# EAGLE design Hatalogico (EAGLE 7.2.0)
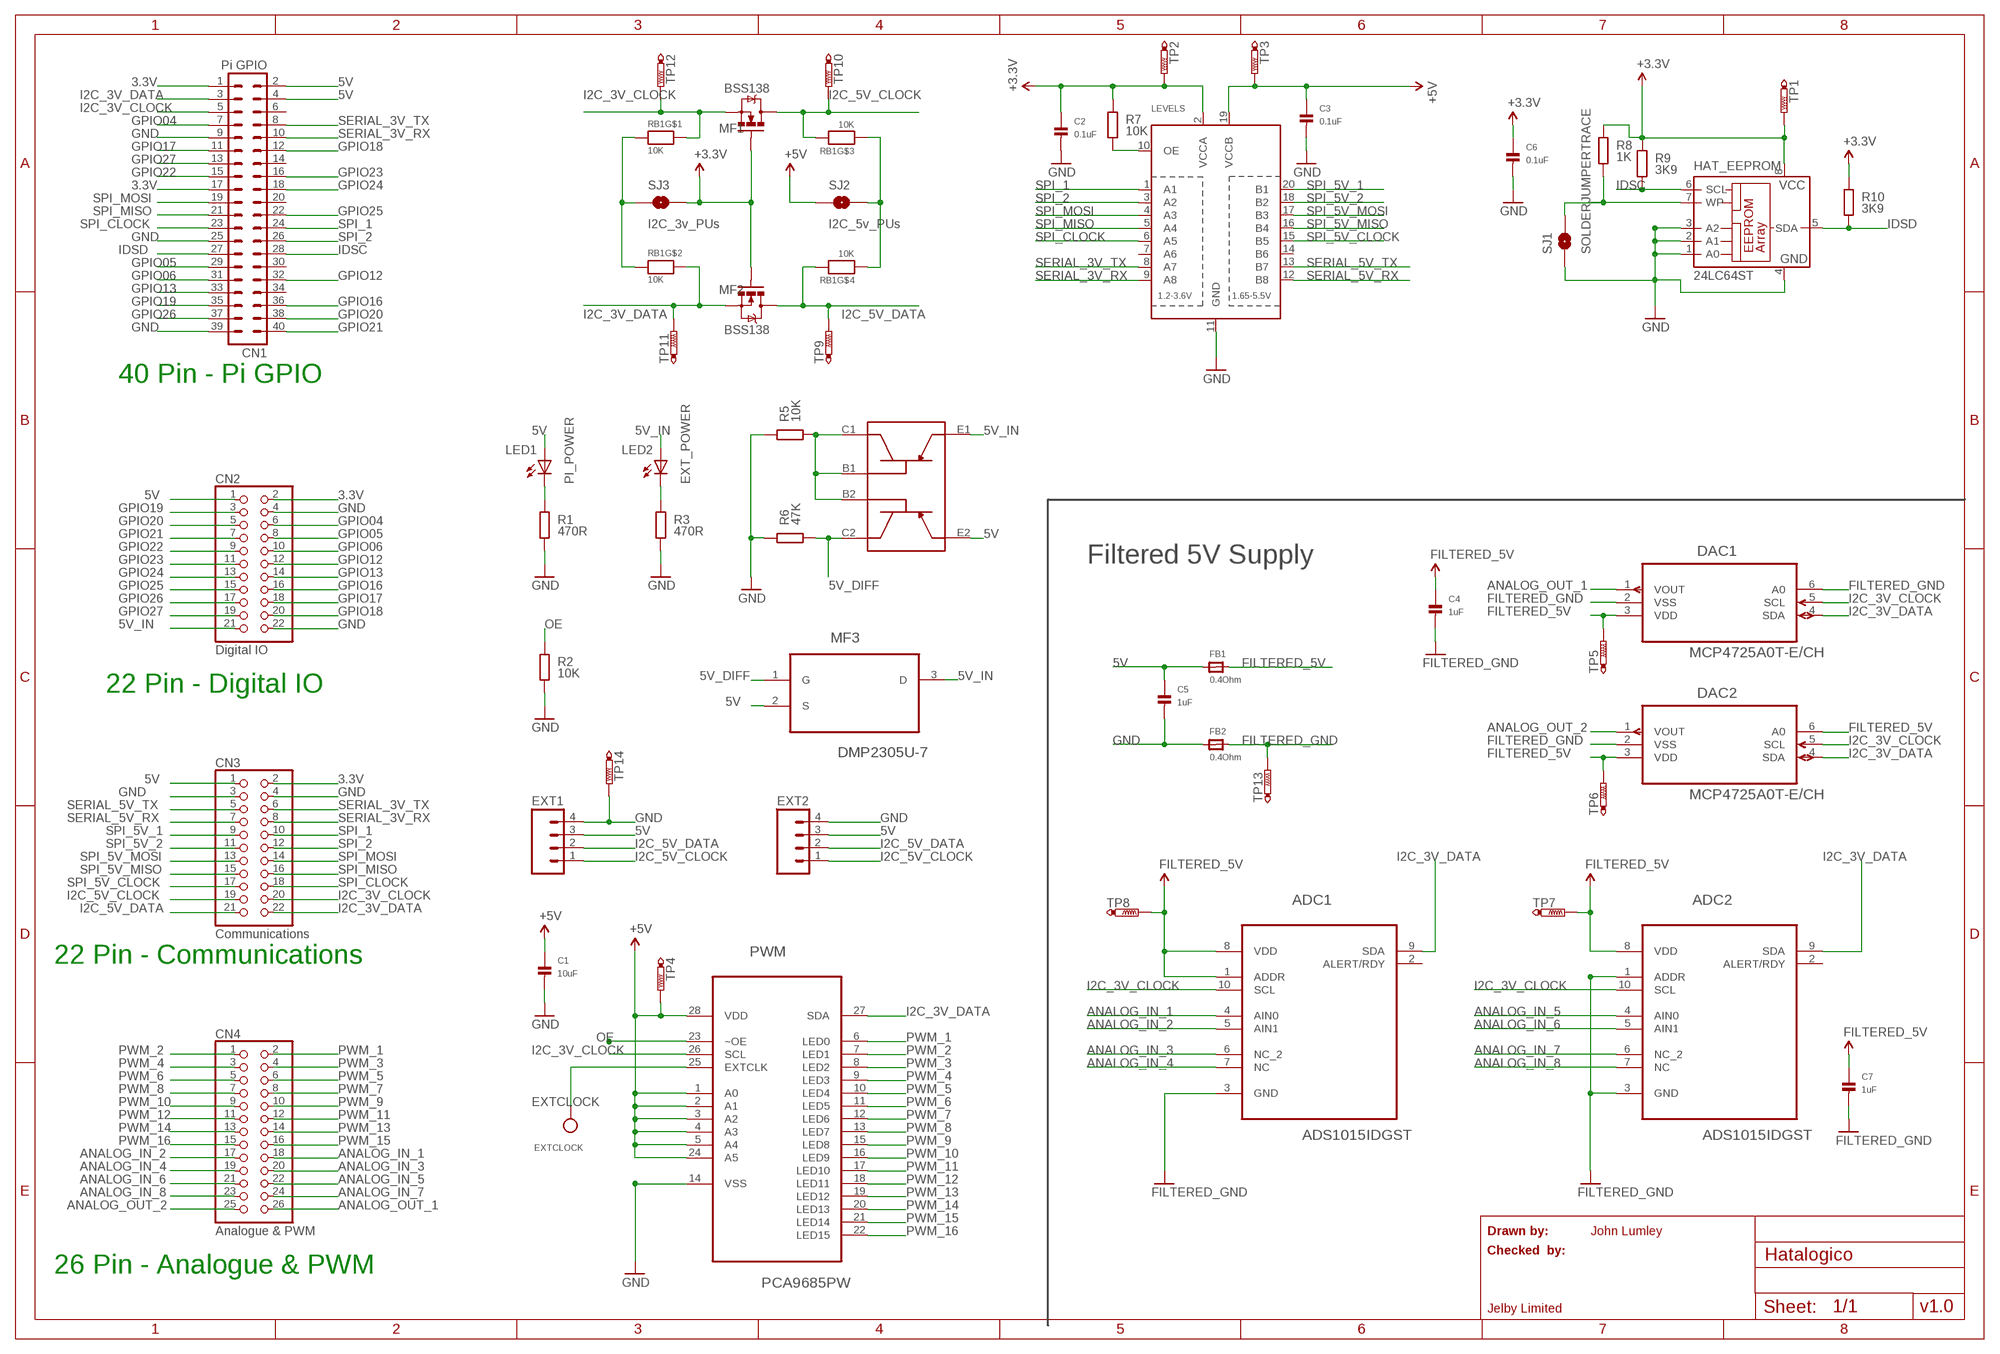
[diagram p0: schematic, sheet 1]

## Parts
ADC1  ADS1015IDGST  [SOP50P490X110-10N]
ADC2  ADS1015IDGST  [SOP50P490X110-10N]
C1  10uF  CAP_CERAMIC0603  [0603]
C2  0.1uF  CAP_CERAMIC0603  [0603]
C3  0.1uF  CAP_CERAMIC0603  [0603]
C4  1uF  CAP_CERAMIC0603  [0603]
C5  1uF  CAP_CERAMIC0603  [0603]
C6  0.1uF  CAP_CERAMIC0603  [0603]
C7  1uF  CAP_CERAMIC0603  [0603]
CN1  Pi GPIO  PIN20X2  [PIN_20X2]
CN2  Digital IO  PINHD-2X11  [2X11]
CN3  Communications  PINHD-2X11  [2X11]
CN4  Analogue & PWM  PINHD-2X13  [2X13]
DAC1  MCP4725A0T-E/CH  [SOT95P270X145-6N]
DAC2  MCP4725A0T-E/CH  [SOT95P270X145-6N]
EXT1  1X04_HEADER"  [1X04_HEADER]
EXT2  1X04_HEADER"  [1X04_HEADER]
EXTCLOCK  TESTPOINT0.1"  [1X01_ROUND]
FB1  0.4Ohm  FERRITE0805  [0805]
FB2  0.4Ohm  FERRITE0805  [0805]
HAT_EEPROM  24LC64ST  [TSSOP8]
LED1  PI_POWER  LEDCHIPLED_1206  [CHIPLED_1206]
LED2  EXT_POWER  LEDCHIPLED_1206  [CHIPLED_1206]
LEVELS  TXB0108PWR  [TSSOP20]
MF1  BSS138  MOSFET-NCHANNELSMD  [SOT23-3]
MF2  BSS138  MOSFET-NCHANNELSMD  [SOT23-3]
MF3  DMP2305U-7  [SOT103P240X110-3N]
PWM  PCA9685PW  [SOP65P640X110-28N]
R1  470R  R-EU_M0805  [M0805]
R2  10K  R-EU_M0805  [M0805]
R3  470R  R-EU_M0805  [M0805]
R5  10K  R-EU_M0805  [M0805]
R6  47K  R-EU_M0805  [M0805]
R7  10K  R-EU_M0805  [M0805]
R8  1K  R-EU_M0805  [M0805]
R9  3K9  R-EU_M0805  [M0805]
R10  3K9  R-EU_M0805  [M0805]
RB1  10K  RESISTOR_4PACK  [RESPACK_4X0603]
SJ1  SOLDERJUMPERTRACE  [SJ_2S-TRACE]
SJ2  I2C_5v_PUs  JUMPER-PAD-2-NOYES_SILK  [PAD-JUMPER-2-NO_YES_SILK]
SJ3  I2C_3v_PUs  JUMPER-PAD-2-NOYES_SILK  [PAD-JUMPER-2-NO_YES_SILK]
T1  DMMT5401  [DMMT5401]
TP1  PTR1TP20SQ  [TP20SQ]
TP2  PTR1TP20SQ  [TP20SQ]
TP3  PTR1TP20SQ  [TP20SQ]
TP4  PTR1TP20SQ  [TP20SQ]
TP5  PTR1TP20SQ  [TP20SQ]
TP6  PTR1TP20SQ  [TP20SQ]
TP7  PTR1TP20SQ  [TP20SQ]
TP8  PTR1TP20SQ  [TP20SQ]
TP9  PTR1TP20SQ  [TP20SQ]
TP10  PTR1TP20SQ  [TP20SQ]
TP11  PTR1TP20SQ  [TP20SQ]
TP12  PTR1TP20SQ  [TP20SQ]
TP13  PTR1TP20SQ  [TP20SQ]
TP14  PTR1TP20SQ  [TP20SQ]

## Nets
3.3V [power]: C2.1 C6.1 CN1.1 CN1.17 CN2.2 CN3.2 HAT_EEPROM.8(VCC) LEVELS.2(VCCA) MF1.1(G) MF2.1(G) R7.2 R8.2 R9.2 R10.2 SJ3.2 TP1.TP TP2.TP ; supply symbol labelled +3.3V
5V [power]: C1.1 C3.1 C5.1 CN1.2 CN1.4 CN2.1 CN3.1 EXT1.3 EXT2.3 FB1.1 LED1.A LEVELS.19(VCCB) MF3.2(S) PWM.1(A0) PWM.2(A1) PWM.3(A2) PWM.4(A3) PWM.5(A4) PWM.24(A5) PWM.28(VDD) SJ2.1 T1.E2 TP3.TP TP4.TP ; supply symbol labelled +5V
5V_DIFF: MF3.1(G) R6.1 T1.C2
5V_IN: CN2.21 LED2.A MF3.3(D) T1.E1
ANALOG_IN_1 [AnalogueIns]: ADC1.4(AIN0) CN4.18
ANALOG_IN_2 [AnalogueIns]: ADC1.5(AIN1) CN4.17
ANALOG_IN_3 [AnalogueIns]: ADC1.6(NC_2) CN4.20
ANALOG_IN_4 [AnalogueIns]: ADC1.7(NC) CN4.19
ANALOG_IN_5 [AnalogueIns]: ADC2.4(AIN0) CN4.22
ANALOG_IN_6 [AnalogueIns]: ADC2.5(AIN1) CN4.21
ANALOG_IN_7 [AnalogueIns]: ADC2.6(NC_2) CN4.24
ANALOG_IN_8 [AnalogueIns]: ADC2.7(NC) CN4.23
ANALOG_OUT_1 [AnalogueOuts]: CN4.26 DAC1.1(VOUT)
ANALOG_OUT_2 [AnalogueOuts]: CN4.25 DAC2.1(VOUT)
EXTCLOCK: EXTCLOCK.1 PWM.25(EXTCLK)
FILTERED_5V [power]: ADC1.1(ADDR) ADC1.8(VDD) ADC2.8(VDD) C4.1 C7.1 DAC1.3(VDD) DAC2.3(VDD) DAC2.6(A0) FB1.2 TP5.TP TP6.TP TP7.TP TP8.TP
FILTERED_GND [power]: ADC1.3(GND) ADC2.1(ADDR) ADC2.3(GND) C4.2 C7.2 DAC1.2(VSS) DAC1.6(A0) DAC2.2(VSS) FB2.2 TP13.TP
GND [power]: C1.2 C2.2 C3.2 C5.2 C6.2 CN1.9 CN1.25 CN1.39 CN2.4 CN2.22 CN3.3 CN3.4 EXT1.4 EXT2.4 FB2.1 HAT_EEPROM.1(A0) HAT_EEPROM.2(A1) HAT_EEPROM.3(A2) HAT_EEPROM.4(GND) LEVELS.11(GND) PWM.14(VSS) R1.1 R2.1 R3.1 R5.2 R6.2 SJ1.1 TP14.TP
GPIO04: CN1.7 CN2.6
GPIO05: CN1.29 CN2.8
GPIO06: CN1.31 CN2.10
GPIO12: CN1.32 CN2.12
GPIO13: CN1.33 CN2.14
GPIO16: CN1.36 CN2.16
GPIO17: CN1.11 CN2.18
GPIO18: CN1.12 CN2.20
GPIO19: CN1.35 CN2.3
GPIO20: CN1.38 CN2.5
GPIO21: CN1.40 CN2.7
GPIO22: CN1.15 CN2.9
GPIO23: CN1.16 CN2.11
GPIO24: CN1.18 CN2.13
GPIO25: CN1.22 CN2.15
GPIO26: CN1.37 CN2.17
GPIO27: CN1.13 CN2.19
I2C_3V_CLOCK [I2C]: ADC1.10(SCL) ADC2.10(SCL) CN1.5 CN3.20 DAC1.5(SCL) DAC2.5(SCL) MF1.2(S) PWM.26(SCL) RB1.8 TP12.TP
I2C_3V_DATA [I2C]: ADC1.9(SDA) ADC2.9(SDA) CN1.3 CN3.22 DAC1.4(SDA) DAC2.4(SDA) MF2.2(S) PWM.27(SDA) RB1.7 TP11.TP
I2C_5V_CLOCK: CN3.19 EXT1.1 EXT2.1 MF1.3(D) RB1.6 TP10.TP
I2C_5V_DATA: CN3.21 EXT1.2 EXT2.2 MF2.3(D) RB1.5 TP9.TP
IDSC: CN1.28 HAT_EEPROM.6(SCL) R9.1
IDSD: CN1.27 HAT_EEPROM.5(SDA) R10.1
LEDOUT: LED1.C R1.2
LEDOUT1: LED2.C R3.2
N$2: R5.1 T1.B1 T1.B2 T1.C1
N$3 [power]: RB1.1 RB1.2 SJ3.1
N$4: RB1.3 RB1.4 SJ2.2
N$8 [power]: LEVELS.10(OE) R7.1
OE: PWM.23(~OE) R2.2
PWM_1: CN4.2 PWM.6(LED0)
PWM_2: CN4.1 PWM.7(LED1)
PWM_3: CN4.4 PWM.8(LED2)
PWM_4: CN4.3 PWM.9(LED3)
PWM_5: CN4.6 PWM.10(LED4)
PWM_6: CN4.5 PWM.11(LED5)
PWM_7: CN4.8 PWM.12(LED6)
PWM_8: CN4.7 PWM.13(LED7)
PWM_9: CN4.10 PWM.15(LED8)
PWM_10: CN4.9 PWM.16(LED9)
PWM_11: CN4.12 PWM.17(LED10)
PWM_12: CN4.11 PWM.18(LED11)
PWM_13: CN4.14 PWM.19(LED12)
PWM_14: CN4.13 PWM.20(LED13)
PWM_15: CN4.16 PWM.21(LED14)
PWM_16: CN4.15 PWM.22(LED15)
SERIAL_3V_RX: CN1.10 CN3.8 LEVELS.9(A8)
SERIAL_3V_TX: CN1.8 CN3.6 LEVELS.8(A7)
SERIAL_5V_RX: CN3.7 LEVELS.12(B8)
SERIAL_5V_TX: CN3.5 LEVELS.13(B7)
SPI_1: CN1.24 CN3.10 LEVELS.1(A1)
SPI_2: CN1.26 CN3.12 LEVELS.3(A2)
SPI_5V_1: CN3.9 LEVELS.20(B1)
SPI_5V_2: CN3.11 LEVELS.18(B2)
SPI_5V_CLOCK: CN3.17 LEVELS.15(B5)
SPI_5V_MISO: CN3.15 LEVELS.16(B4)
SPI_5V_MOSI: CN3.13 LEVELS.17(B3)
SPI_CLOCK: CN1.23 CN3.18 LEVELS.6(A5)
SPI_MISO: CN1.21 CN3.16 LEVELS.5(A4)
SPI_MOSI: CN1.19 CN3.14 LEVELS.4(A3)
WP: HAT_EEPROM.7(WP) R8.1 SJ1.2
Unconnected: ADC1.2(ALERT/RDY) ADC2.2(ALERT/RDY) CN1.6 CN1.14 CN1.20 CN1.30 CN1.34 LEVELS.7(A6) LEVELS.14(B6)

## Notes on the sheet
- 40 Pin - Pi GPIO
- Filtered 5V Supply
- 22 Pin - Digital IO
- 22 Pin - Communications
- Drawn by: | John Lumley
- Checked  by:
- 26 Pin - Analogue & PWM
- Jelby Limited | v1.0

## Library data of the parts
ADC1 ADC2 = Jelby:ADS1015IDGST: Ultra-Small, Low-Power, 12-Bit Analog-to-Digital Converter with Internal Reference; MPN: ADS1015IDGST; OC_FARNELL: 1778211; OC_NEWARK: 35R0211; PACKAGE: MSOP-10; SUPPLIER: Texas Instruments
C1-C7 = microbuilder:CAP_CERAMIC: Ceramic Capacitors 0402 - 0402 Surface Mount Capacitors 16pF 50V 5% [Digikey: 445-4899-2-ND] 18pF 50V 5% [Digikey: 490-1281-2-ND] 22pF 50V 5% [Digikey: 490-1283-2-ND] 68pF 50V 5% [Digikey: 490-1289-2-ND] 0.1uF 10V 10% [Digikey: 490-1318-2-ND] 1.0uF 6.3V 10% [Digikey: 490-1320-2-ND] 0603 - 0603 Surface Mount Capacitors 16 pF 50V 5% [Digikey: 445-5051-2-ND] 22 pF 50V [Digikey: PCC220ACVTR-ND] 33 pF 50V 5% [Digikey: 490-1415-1-ND] 56pF 50V 5% [Digikey: 490-1421-1-ND] 220pF 50V 5% [Digikey: 445-1285-1-ND] 680 pF 50V 2200 pF 50V 5% C0G [Digikey: 445-1297-1-ND] 5600 pF 100V 5% X7R [Digikey: 478-3711-1-ND] 0.1 µF 25V 10% [Digikey: PCC2277TR-ND] 0.22 µF 16V 10% X7R [Digikey: 445-1318-1-ND] 1.0 µF 25V 10% [Digikey: 445-5146-2-ND] 0603 - RF Specific 3pF 250V +/-0.1pF RF [Digikey: 712-1347-1-ND] 18 pF 250V 5% [Digikey: 478-3505-1-ND or 712-1322-1-ND] 56 pF 250V 5% C0G RF [Digikey: 490-4867-1-ND] 68 pF 250V RF [Digikey: 490-4868-1-ND] 0805 - 0805 Surface Mount Capacitors 220 pF 250V 2% RF Ceramic Capacitor [Digikey: 712-1398-1-ND] 1000 pF 50V 2% NP0 Ceramic Capacitor [Digikey: 478-3760-1-ND] 0.1 µF 25V 10% Ceramic Capacitor [Digikey: PCC1828TR-ND] 1.0 µF 16V 10% Ceramic Capacitor[Digikey: 490-1691-2-ND] 10.0 µF 10V 10% Ceramic Capacitor[Digikey: 709-1228-1-ND] 10.0 uF 16V 10% Ceramic Capacitor [Digikey: 478-5165-2-ND] 47 uF 6.3V 20% Ceramic Capacitor [Digikey: 587-1779-1-ND or 399-5506-1-ND] 1206 - 1206 Surface Mount Capacitors 47uF 10V 20% Ceramic Capacitor [Digikey: 490-5528-1-ND or 399-5508-1-ND or 445-6010-1-ND] 100uF 6.3V -20%, +80% Y5V Ceramic Capacitor (Digikey: 490-4512-1-ND, Mouser: 81-GRM31CF50J107ZE1L)
CN1 = FLYFISH:PIN20X2
CN2 CN3 = pinhead:PINHD-2X11: PIN HEADER
CN4 = pinhead:PINHD-2X13: PIN HEADER
DAC1 DAC2 = Jelby:MCP4725A0T-E/CH: 12-Bit Digital-to-Analog Converter with EEPROM; MPN: MCP4725A0T-E/CH; OC_FARNELL: 1578449; OC_NEWARK: 77M3032; PACKAGE: SOT-23-6; SUPPLIER: Microchip
EXT1 EXT2 = RBBB:1X04_HEADER: Header 4 Standard 4-pin 0.1" header. Use with straight break away headers (SKU : PRT-00116), right angle break away headers (PRT-00553), swiss pins (PRT-00743), machine pins (PRT-00117), and female headers (PRT-00115). Molex polarized connector foot print use with SKU : PRT-08231 with associated crimp pins and housings.
EXTCLOCK = microbuilder:TESTPOINT: Test Point Various test points for characterisation and PCB testing TESTPOINT_SMT - Compact Surface Mount Test Point [Digikey: 5016KTR-ND]; BOM: EXCLUDE
FB1 FB2 = microbuilder:FERRITE: Ferrite Bead 0603 MMZ1608B121C - 120 Ohm @ 100MHz, 600mA, 0.15 Ohm DC Resistance - Digikey: 445-2164-1-ND BK1608HW121-T - 120 Ohm, 600mA Ferrite Chip - Digikey: 587-1876-2-ND 0805 HZ0805B272R-10 - 2.7K Ohm @ 100MHz, 200mA, 0.8 Ohm DC Resistance - Digikey: 240-2504-1-ND (see also Murata BLM21BD272SN1L) MMZ2012Y152B - 1.5K Ohm @ 100MHz, 500mA, 0.4 Ohm DC Resistance - Digikey: 445-1560-1-ND - Mainly for high frequency (80-400MHz) MMZ2012R102A - 1K Ohm @ 100MHz, 500mA, 0.3 Ohm DC Resistance - Digikey: 445-1555-2-ND - More general purpose (10-200MHz)
HAT_EEPROM = microchip:24*: Serial EEPROM I2C; MF: MICROCHIP; MPN: 24LC64X-I/ST; OC_FARNELL: 1296582; OC_NEWARK: 96K4081
LED1 LED2 = adafruit:LED: LED OSRAM: - CHIPLED LG R971, LG N971, LY N971, LG Q971, LY Q971, LO R971, LY R971 LH N974, LH R974 LS Q976, LO Q976, LY Q976 LO Q996 - Hyper CHIPLED LW Q18S LB Q993, LB Q99A, LB R99A - SideLED LS A670, LO A670, LY A670, LG A670, LP A670 LB A673, LV A673, LT A673, LW A673 LH A674 LY A675 LS A676, LA A676, LO A676, LY A676, LW A676 LS A679, LY A679, LG A679 - Hyper Micro SIDELED® LS Y876, LA Y876, LO Y876, LY Y876 LT Y87S - SmartLED LW L88C, LW L88S LB L89C, LB L89S, LG L890 LS L89K, LO L89K, LY L89K LS L896, LA L896, LO L896, LY L896 - TOPLED LS T670, LO T670, LY T670, LG T670, LP T670 LSG T670, LSP T670, LSY T670, LOP T670, LYG T670 LG T671, LOG T671, LSG T671 LB T673, LV T673, LT T673, LW T673 LH T674 LS T676, LA T676, LO T676, LY T676, LB T676, LH T676, LSB T676, LW T676 LB T67C, LV T67C, LT T67C, LS T67K, LO T67K, LY T67K, LW E67C LS E67B, LA E67B, LO E67B, LY E67B, LB E67C, LV E67C, LT E67C LW T67C LS T679, LY T679, LG T679 LS T770, LO T770, LY T770, LG T770, LP T770 LB T773, LV T773, LT T773, LW T773 LH T774 LS E675, LA E675, LY E675, LS T675 LS T776, LA T776, LO T776, LY T776, LB T776 LHGB T686 LT T68C, LB T68C - Hyper Mini TOPLED® LB M676 - Mini TOPLED Santana® LG M470 LS M47K, LO M47K, LY M47K Source: http://www.osram.convergy.de/
LEVELS = microbuilder:TXB0108PWR: 8-Bit Bi-Directional Level Shifter 1.2V-3.6V (VCCA) to 1.65V-5.5V (VCCB) bi-directional level shifter with auto direction sensing. Max data rate - VCCA 1.8V: 20Mbps (50ns), VCCA 3.3V: 100Mbps (10ns) Digikey: 296-21527-1-ND
MF1 MF2 = SparkFun:MOSFET-NCHANNEL
MF3 = Jelby:DMP2305U-7: P-CHANNEL ENHANCEMENT MODE MOSFET; MPN: DMP2305U-7; OC_FARNELL: 1858668; OC_NEWARK: 23T5607; PACKAGE: SOT-23-3; SUPPLIER: DIODES INC.
PWM = Jelby:PCA9685PW: 16-channel, 12-bit PWM Fm+ I2C-bus LED controller; MPN: PCA9685PW; OC_FARNELL: 1854074; OC_NEWARK: 19T6398; PACKAGE: TSSOP-28; SUPPLIER: NXP
R1-R3 R5-R10 = resistor:R-EU_: RESISTOR, European symbol; TOLERANCE: 5%
RB1 = microbuilder:RESISTOR_4PACK: Resistor Packs (4 resistors) 4 x 0603 10K 1/16W - Digikey: YC164J-10KCT-ND
SJ1 = SparkFun-Retired:SOLDERJUMPER: Solder Jumper Standard SMD solder jumper. Used to automate production. Two varients : Normally Open and Normally Closed are the same, but have different paste layers. NC will have a large amount of paste and should jumper during reflow.
SJ2 SJ3 = SparkFun-Passives:JUMPER-PAD-2-NO
T1 = Jelby:DMMT5401: SOT-26 Dual PNP Transistors
TP1-TP14 = testpad:PTR1: TEST PIN

## Net classes
0 default: width 0.203 mm, drill 0.508 mm, clearance 0.203 mm
1 power: width 0.203 mm, drill 0.508 mm, clearance 0.203 mm
2 GND: width 0.203 mm, drill 0.508 mm, clearance 0.203 mm
3 I2C: width 0.203 mm, drill 0.508 mm, clearance 0.203 mm
4 AnalogueOuts: width 0.203 mm, drill 0.508 mm, clearance 0.203 mm
5 AnalogueIns: width 0.203 mm, drill 0.508 mm, clearance 0.203 mm

## Board
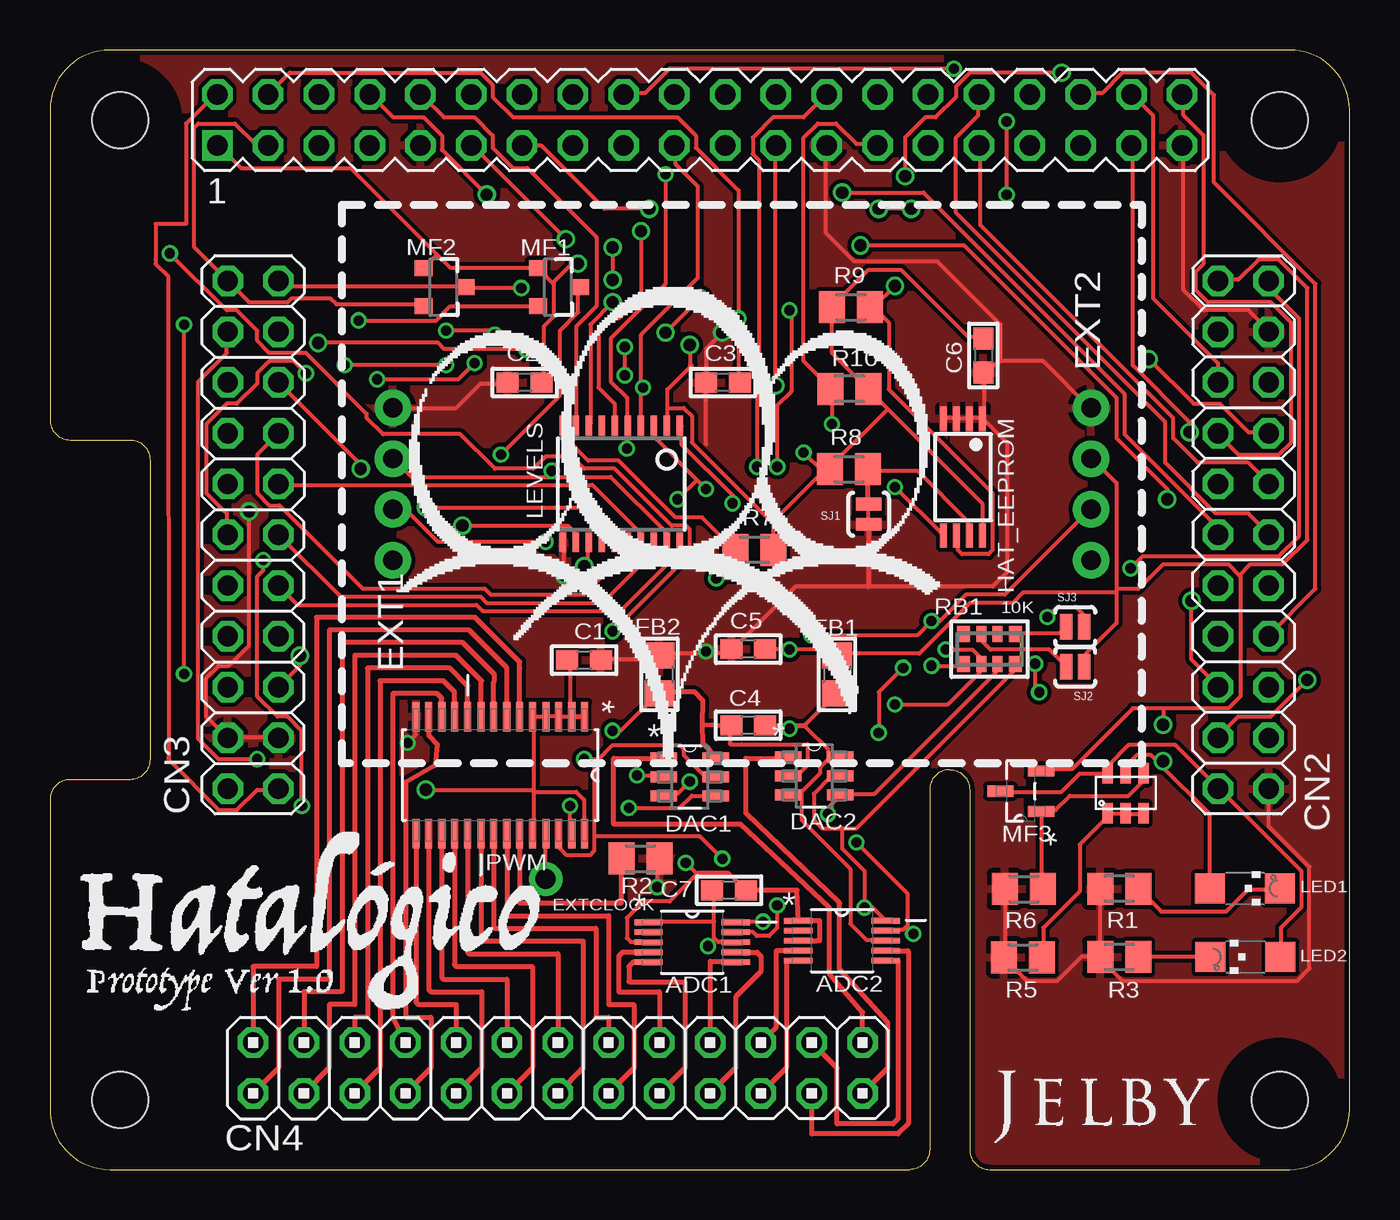
[diagram p1: board, top side]
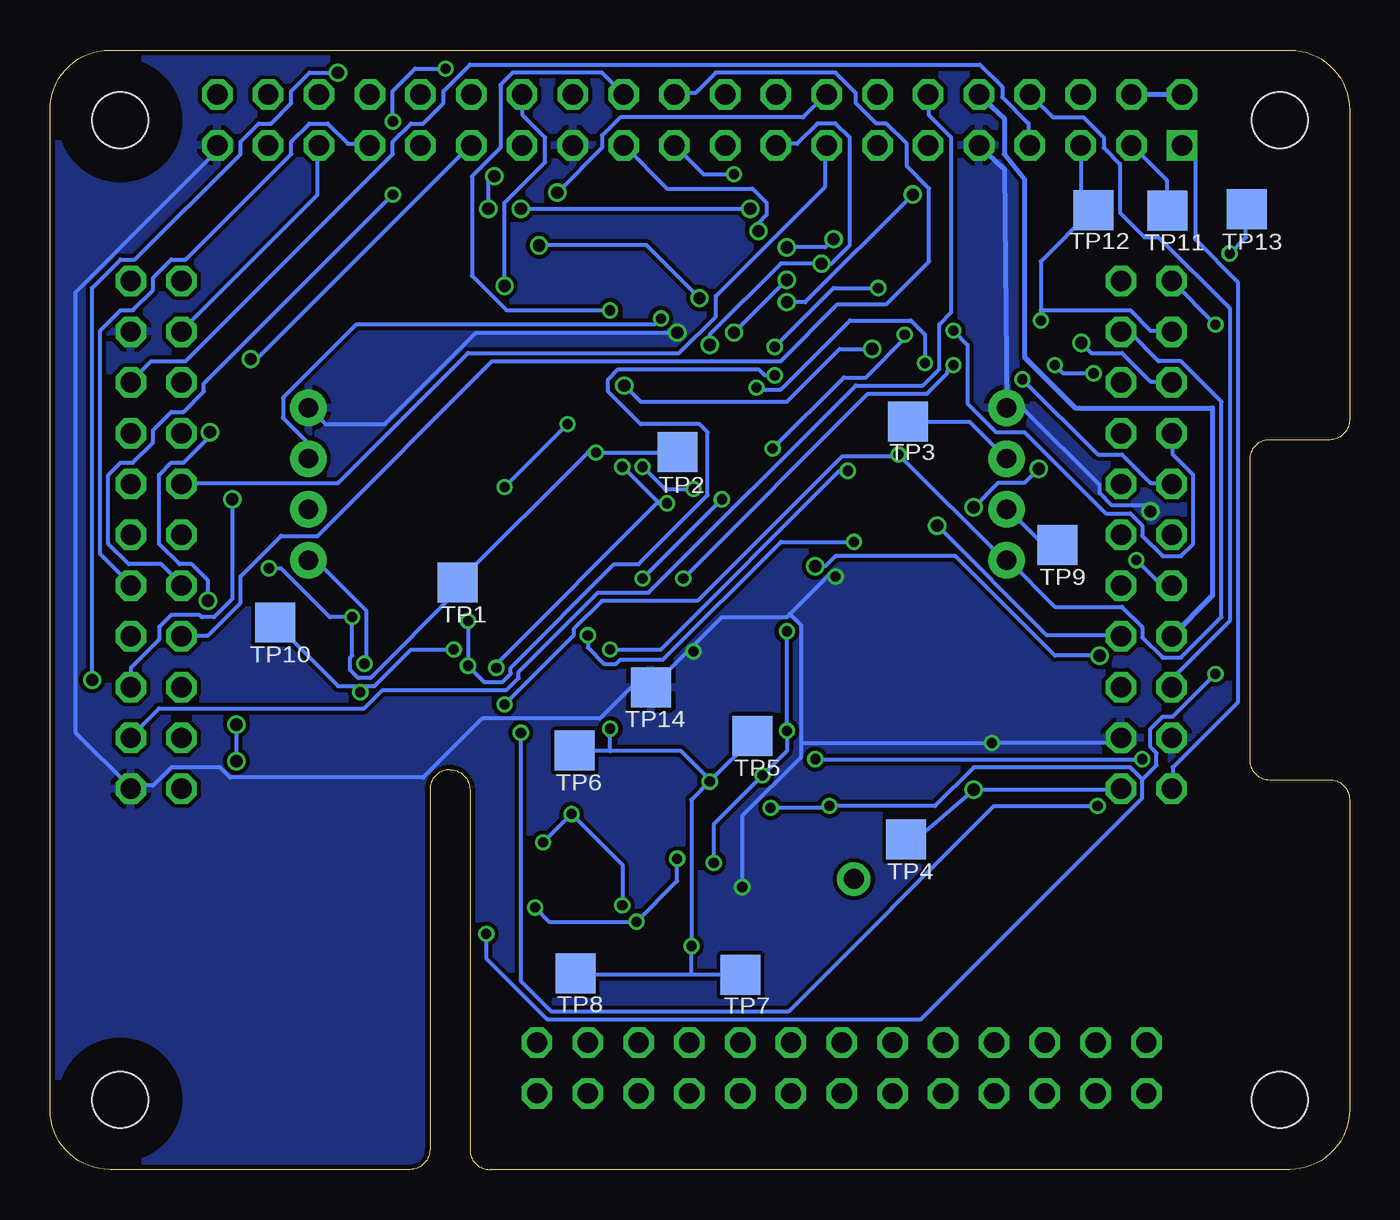
[diagram p2: board, bottom side, seen from below]

Size 65 x 56 mm. Coordinates in mm from the lower left corner, seen from the top.
Outline: 0,3 arc90 3,0 43,0 arc90 44,1 44,19 arc-90 45,20 arc-90 46,19 46,1 arc90 47,0 62,0 arc90 65,3 65,53 arc90 62,56 3,56 arc90 0,53 0,37.5 arc90 1,36.5 4,36.5 arc-90 5,35.5 5,20.5 arc-90 4,19.5 1,19.5 arc90 0,18.5 0,3
Copper layers (1*16): Top 0.035mm / dielectric 1.5mm / Bottom 0.035mm
Design rules "ITEADstudio_DRC": minimum track width 6mil, minimum drill 12mil, track to track 6mil, track to pad 6mil, pad to pad 6mil, via to via 6mil, smd to smd 0mil, copper to edge 10mil, drill to drill 10mil, minimum pad ring 10mil, minimum via ring 6mil, stop-mask expansion 2mil, vias tented up to drill 100mil, thermal gap 10mil
Holes 2.8 mm at 3.5,3.5 3.5,52.5 61.5,52.5 61.5,3.5
tRestrict: area 1.9,51 to 5,54; area 60,51 to 63,54; area 60,1.9 to 63,5; area 1.9,1.9 to 5,5
bRestrict: area 1.9,1.9 to 5,5; area 1.9,51 to 5,54; area 60,1.9 to 63,5; area 60,51 to 63,54

### Footprints (pad centres in the part's own frame; a part is rotated, then mirrored left to right if it is on the bottom)
SOP50P490X110-10N = smd 1.422 x 0.279: 1 -2.184,0.991; 2 -2.184,0.508; 3 -2.184,0; 4 -2.184,-0.508; 5 -2.184,-0.991; 6 2.184,-0.991; 7 2.184,-0.508; 8 2.184,0; 9 2.184,0.508; 10 2.184,0.991
0603 = smd 1.1 x 1: 1 -0.85,0; 2 0.85,0
PIN_20X2 = drill 1.016 square: 1 -24.13,-1.27 | drill 1.016 octagon: 2 -24.13,1.27; 3 -21.59,-1.27; 4 -21.59,1.27; 5 -19.05,-1.27; 6 -19.05,1.27; 7 -16.51,-1.27; 8 -16.51,1.27; 9 -13.97,-1.27; 10 -13.97,1.27; 11 -11.43,-1.27; 12 -11.43,1.27; 13 -8.89,-1.27; 14 -8.89,1.27; 15 -6.35,-1.27; 16 -6.35,1.27; 17 -3.81,-1.27; 18 -3.81,1.27; 19 -1.27,-1.27; 20 -1.27,1.27; 21 1.27,-1.27; 22 1.27,1.27; 23 3.81,-1.27; 24 3.81,1.27; 25 6.35,-1.27; 26 6.35,1.27; 27 8.89,-1.27; 28 8.89,1.27; 29 11.43,-1.27; 30 11.43,1.27; 31 13.97,-1.27; 32 13.97,1.27; 33 16.51,-1.27; 34 16.51,1.27; 35 19.05,-1.27; 36 19.05,1.27; 37 21.59,-1.27; 38 21.59,1.27; 39 24.13,-1.27; 40 24.13,1.27
2X11 = drill 1.016 octagon: 1 -12.7,-1.27; 2 -12.7,1.27; 3 -10.16,-1.27; 4 -10.16,1.27; 5 -7.62,-1.27; 6 -7.62,1.27; 7 -5.08,-1.27; 8 -5.08,1.27; 9 -2.54,-1.27; 10 -2.54,1.27; 11 0,-1.27; 12 0,1.27; 13 2.54,-1.27; 14 2.54,1.27; 15 5.08,-1.27; 16 5.08,1.27; 17 7.62,-1.27; 18 7.62,1.27; 19 10.16,-1.27; 20 10.16,1.27; 21 12.7,-1.27; 22 12.7,1.27
2X13 = drill 1.016 octagon: 1 -15.24,-1.27; 2 -15.24,1.27; 3 -12.7,-1.27; 4 -12.7,1.27; 5 -10.16,-1.27; 6 -10.16,1.27; 7 -7.62,-1.27; 8 -7.62,1.27; 9 -5.08,-1.27; 10 -5.08,1.27; 11 -2.54,-1.27; 12 -2.54,1.27; 13 0,-1.27; 14 0,1.27; 15 2.54,-1.27; 16 2.54,1.27; 17 5.08,-1.27; 18 5.08,1.27; 19 7.62,-1.27; 20 7.62,1.27; 21 10.16,-1.27; 22 10.16,1.27; 23 12.7,-1.27; 24 12.7,1.27; 25 15.24,-1.27; 26 15.24,1.27
SOT95P270X145-6N = smd 1.321 x 0.559: 1 -1.295,0.94; 2 -1.295,0; 3 -1.295,-0.94; 4 1.295,-0.94; 5 1.295,0; 6 1.295,0.94
1X04_HEADER = drill 0.965 pad 1.829: 1 0,0; 2 2.54,0; 3 5.08,0; 4 7.62,0
1X01_ROUND = drill 1 pad 1.676: 1 0,0
0805 = smd 1.3 x 1.5: 1 -0.95,0; 2 0.95,0
TSSOP8 = smd 0.35 x 1.2: 1 -0.975,-2.925; 2 -0.325,-2.925; 3 0.325,-2.925; 4 0.975,-2.925; 5 0.975,2.925; 6 0.325,2.925; 7 -0.325,2.925; 8 -0.975,2.925
CHIPLED_1206 = smd 1.5 x 1.5: A 0,-1.75; C 0,1.75
TSSOP20 = smd 0.305 x 0.991: 1 -2.925,-2.918; 2 -2.275,-2.918; 3 -1.625,-2.918; 4 -0.975,-2.918; 5 -0.325,-2.918; 6 0.325,-2.918; 7 0.975,-2.918; 8 1.625,-2.918; 9 2.275,-2.918; 10 2.925,-2.918; 11 2.925,2.918; 12 2.275,2.918; 13 1.625,2.918; 14 0.975,2.918; 15 0.325,2.918; 16 -0.325,2.918; 17 -0.975,2.918; 18 -1.625,2.918; 19 -2.275,2.918; 20 -2.925,2.918
SOT23-3 = smd 0.8 x 0.9: 1 -0.95,-1; 2 0.95,-1; 3 0,1.1
SOT103P240X110-3N = smd 1.321 x 0.559: 1 -1.016,1.016; 2 -1.016,-1.016; 3 1.016,0
SOP65P640X110-28N = smd 1.473 x 0.356: 1 -2.921,4.216; 2 -2.921,3.581; 3 -2.921,2.921; 4 -2.921,2.286; 5 -2.921,1.626; 6 -2.921,0.965; 7 -2.921,0.33; 8 -2.921,-0.33; 9 -2.921,-0.965; 10 -2.921,-1.626; 11 -2.921,-2.286; 12 -2.921,-2.921; 13 -2.921,-3.581; 14 -2.921,-4.216; 15 2.921,-4.216; 16 2.921,-3.581; 17 2.921,-2.921; 18 2.921,-2.286; 19 2.921,-1.626; 20 2.921,-0.965; 21 2.921,-0.33; 22 2.921,0.33; 23 2.921,0.965; 24 2.921,1.626; 25 2.921,2.286; 26 2.921,2.921; 27 2.921,3.581; 28 2.921,4.216
M0805 = smd 1.3 x 1.6: 1 -0.95,0; 2 0.95,0
RESPACK_4X0603 = smd 0.65 x 0.8: 1 -1.3,-0.75; 4 1.3,-0.75; 5 1.3,0.75; 8 -1.3,0.75 | smd 0.5 x 0.8: 2 -0.4,-0.75; 3 0.4,-0.75; 6 0.4,0.75; 7 -0.4,0.75
SJ_2S-TRACE = smd 0.635 x 1.27: 1 -0.508,0; 2 0.508,0
PAD-JUMPER-2-NO_YES_SILK = smd 0.635 x 1.27: 1 -0.45,0; 2 0.45,0
DMMT5401 = smd 0.508 x 1.016: B1 0,-1; B2 0.9,-1; C1 -0.9,-1; C2 0.9,1; E1 -0.9,1; E2 0,1
TP20SQ = smd 2 x 2: TP 0,0

### Placement (x,y rotation side)
ADC1  32.12,11.37 0 top
ADC2  39.62,11.45 0 top
C1  26.72,25.48 0 top
C2  23.75,39.37 180 top
C3  33.66,39.37 180 top
C4  34.92,22.23 180 top
C5  34.92,26.04 180 top
C6  46.68,40.72 270 top
C7  33.97,13.97 0 top
CN1  32.5,52.5 0 top
CN2  59.69,31.75 270 top
CN3  10.16,31.75 90 top
CN4  25.4,5.08 0 top
DAC1  32,19.64 0 top
DAC2  38.23,19.68 0 top
EXT1  17.14,30.48 90 top
EXT2  52.07,30.48 90 top
EXTCLOCK  24.79,14.53 0 top
FB1  39.37,24.77 270 top
FB2  30.48,24.77 270 top
HAT_EEPROM  45.67,34.63 180 top
LED1  59.77,14.06 270 top
LED2  59.79,10.63 90 top
LEVELS  28.57,34.29 180 top
MF1  25.4,44.13 270 top
MF2  19.68,44.13 270 top
MF3  48.55,18.93 180 top
PWM  22.52,19.73 270 top
R1  53.48,14.05 0 top
R2  29.53,15.56 180 top
R3  53.49,10.63 0 top
R5  48.67,10.61 180 top
R6  48.7,14.03 180 top
R7  35.24,30.99 0 top
R8  39.97,35.03 180 top
R9  40.05,43.13 180 top
R10  39.98,39.04 0 top
RB1  46.99,26.04 180 top
SJ1  40.94,32.78 90 top
SJ2  51.28,25.15 180 top
SJ3  51.28,27.14 0 top
T1  53.8,18.83 0 top
TP1  44.62,29.35 0 bottom
TP2  33.62,35.88 0 bottom
TP3  22.08,37.42 0 bottom
TP4  22.18,16.5 0 bottom
TP5  29.85,21.68 0 bottom
TP6  38.76,20.95 0 bottom
TP7  30.45,9.73 0 bottom
TP8  38.7,9.8 0 bottom
TP9  14.61,31.23 0 bottom
TP10  53.75,27.35 0 bottom
TP11  9.11,47.97 0 bottom
TP12  12.82,47.98 0 bottom
TP13  5.13,48.05 0 bottom
TP14  34.95,24.12 0 bottom

### Tracks (layer width: path | path; a pad name or v marks a point on that pad's centre or on a via)
3.3V  (via drill 0.51, 0.61)
  Top 0.203: 25.15,44.35 24.49,45.01 MF1.1 24.38,45.11 20.02,45.11 19.36,45.77 | 25.15,44.35 25.2,44.3 25.2,42.67 24.69,42.16 24.69,39.42 C2.1 | 19.36,45.77 15.04,50.09 9.55,50.09 8.43,51.21 CN1.1 | v26.42,45.31 26.11,45.31 25.15,44.35 | 32.05,40.18 30.89,39.01 30.89,38.1 | 32.05,40.18 32.11,40.23 | 30.89,38.1 30.89,37.29 LEVELS.2 | 51.71,27.23 SJ3.2 51.71,27.33 51.71,27.74 51.31,28.14 50.39,28.14 v49.89,27.64 | 36.12,32.36 32.11,36.37 32.11,37.69 31.7,38.1 30.89,38.1 | 36.12,32.36 36.17,32.31 36.17,30.99 R7.2 | v32,41.25 32,40.23 32.05,40.18 | C6.1 46.63,41.66 45.92,41.66 42.57,45.01 40.95,45.01 39.12,43.18 R9.2 39.12,43.08 39.12,40.84 40.84,39.12 R10.2 40.95,39.01 41.91,38.05 | 41.91,38.05 46.63,33.33 46.63,31.8 HAT_EEPROM.8 | 41.91,38.05 39.12,35.26 39.12,35.05 R8.2 | 36.12,32.36 38.71,34.95 39.01,34.95 R8.2 | CN2.2 60.96,44.09 62.48,42.57 62.48,31.7 61.47,30.68 54.66,30.68 v54.05,30.07 | v37.69,35.87 38.61,34.95 R8.2 | 19.36,45.77 18.69,45.11 MF2.1
  Bottom 0.203: CN1.17 28.65,51.31 27.64,51.31 26.62,52.32 25.7,52.32 24.99,51.61 24.99,46.23 25.91,45.31 v26.42,45.31 28.45,45.31 32,41.76 v32,41.25 | CN3.2 8.84,19.1 8.84,20.12 5.59,23.37 5.59,44.4 7.72,46.53 7.72,50.6 8.33,51.21 CN1.1 | TP2.TP 33.63,35.87 v37.69,35.87 38.1,35.87 44.6,29.36 TP1.TP 44.7,29.26 44.7,28.85 48.97,24.59 49.58,24.59 49.99,24.99 49.99,25.6 49.89,25.7 v49.89,27.64 51,27.64 53.44,30.07 v54.05,30.07
5V  (via drill 0.51, 0.61)
  Top 0.203: 24.18,16.87 PWM.24 24.18,16.97 24.18,18.9 | 24.18,22.45 PWM.5 | PWM.2 26.11,22.66 26.11,22.65 | 24.18,19 24.18,22.35 PWM.5 | 24.18,19 24.18,18.9 | v18.8,19 24.18,19 | PWM.2 26.01,22.66 25.5,22.66 PWM.3 25.4,22.66 24.89,22.66 PWM.4 24.79,22.66 24.18,22.66 PWM.5 | PWM.2 26.01,22.76 26.01,25.5 C1.1 | C3.1 34.44,39.42 v34.44,42.57 34.44,48.97 32.31,51.1 32.31,51.71 31.39,52.63 23.16,52.63 22.15,53.65 22.15,54.25 21.54,54.86 11.99,54.86 10.97,53.85 CN1.4 | 55.52,20.27 58.01,17.78 58.01,14.12 LED1.A | 55.52,20.27 55.07,20.73 54.36,20.73 53.85,20.22 53.85,19.91 T1.E2 | 53.34,29.06 53.34,34.34 52.12,35.56 EXT2.3 | 53.34,29.06 53.34,28.85 | 53.34,28.85 53.34,27.33 51.82,25.81 51.82,25.2 SJ2.1 | 55.68,23.06 58.93,23.06 59.54,23.67 59.54,29.67 59.49,29.72 | 55.68,23.06 54.15,23.06 51.1,20.02 49.58,20.02 MF3.2 | 59.49,29.72 58.93,30.28 55.68,30.28 54.46,29.06 53.34,29.06 | 53.34,28.85 48.67,28.85 48.16,28.35 46.02,28.35 43.48,25.81 39.42,25.81 FB1.1 39.32,25.81 39.12,26.01 v36.98,26.01 35.87,26.01 C5.1 | 59.49,29.72 60.05,30.28 61.67,30.28 62.89,31.5 62.89,44.09 61.47,45.52 60.45,45.52 59.44,44.5 58.42,44.5 CN2.1 | v55.68,20.42 55.52,20.27 | 55.68,23.06 v55.68,22.25 | 25.09,34.65 18.09,34.65 17.17,35.56 EXT1.3 | 25.09,34.65 28.04,34.65 30.79,31.9 30.79,31.39 LEVELS.19 | CN3.1 11.38,19 10.36,19 9.35,17.98 8.43,17.98 5.93,20.52 5.93,20.55 5.93,20.64 5.9,44.68 5.29,45.3 5.28,45.52 5.28,47.3 6.81,47.3 6.81,52.32 8.33,53.85 CN1.2 | v25.09,34.95 25.09,34.65 | 24.18,18.9 26.31,18.9 26.72,18.49 26.72,16.87 PWM.28
  Top 0.254: PWM.2 26.11,22.65 PWM.1
  Bottom 0.203: CN3.1 11.48,19 v18.8,19 21.39,16.76 22.96,15.6 TP4.TP | v55.68,22.25 v55.68,20.42 | TP3.TP 22.05,37.39 19,37.39 17.17,35.56 EXT1.3 | v34.44,42.57 34.75,42.27 49.68,42.27 53.34,38.61 53.34,37.59 52.12,36.37 52.12,35.56 EXT2.3 | v25.09,34.95 25.5,34.95 34.44,26.01 v36.98,26.01
  Bottom 0.254: CN1.2 CN1.4
5V_DIFF
  Top 0.203: T1.C2 54.66,19.81 54.66,19.41 53.95,18.69 51,18.69 50.29,17.98 49.58,17.98 MF3.1 49.58,17.88 49.58,14.12 R6.1
5V_IN
  Top 0.203: MF3.3 47.55,18.9 50.6,18.9 51.51,19.81 52.83,19.81 T1.E1 52.93,19.91 52.93,20.22 53.95,21.23 56.29,21.23 58.42,19.1 | 58.42,19.1 62.59,14.94 62.59,13.11 61.57,12.09 61.57,10.67 LED2.A | 58.42,19.1 CN2.21
ANALOG_IN_1
  Top 0.254: ADC1.4 28.64,10.86 28.45,10.67 28.45,8.89 30.48,8.89 CN4.18
ANALOG_IN_2
  Top 0.254: ADC1.5 29.18,10.38 28.96,10.16 28.96,9.4 31.75,9.4 31.75,5.08 CN4.17
ANALOG_IN_3
  Top 0.254: ADC1.6 33.05,10.38 33.02,10.41 CN4.20
ANALOG_IN_4
  Top 0.254: ADC1.7 35.37,10.86 35.56,10.67 35.56,9.91 34.29,8.64 34.29,5.08 CN4.19
ANALOG_IN_5
  Top 0.254: ADC2.4 36.34,10.94 36.32,10.92 36.32,7.11 CN4.22
ANALOG_IN_6
  Top 0.254: ADC2.5 36.87,10.46 36.83,10.41 36.83,5.08 CN4.21
ANALOG_IN_7
  Top 0.254: ADC2.6 42.37,10.46 42.42,10.41 42.42,2.54 42.16,2.29 39.37,2.29 39.37,5.08 CN4.24
ANALOG_IN_8
  Top 0.254: ADC2.7 42.91,10.94 42.93,10.92 42.93,2.29 42.42,1.78 38.1,1.78 CN4.23
ANALOG_OUT_1
  Top 0.254: CN4.26 40.64,7.87 38.99,9.78 38.99,13.08 34.54,17.27 28.19,17.27 28.19,20.57 30.07,20.57 DAC1.1
ANALOG_OUT_2
  Top 0.254: CN4.25 41.91,5.08 41.91,7.37 39.5,10.03 39.5,13.34 34.81,17.82 34.81,20.57 36.88,20.57 DAC2.1
EXTCLOCK
  Top 0.203: EXTCLOCK.1 24.79,16.76 PWM.25
FILTERED_5V  (via drill 0.51)
  Top 0.203: 37.54,18.85 38.51,19.81 38.51,20.12 39.01,20.62 DAC2.6 38.91,20.62 38.91,21.03 37.8,22.15 37.78,22.23 37.8,22.25 39.32,23.77 FB1.2 | 37.54,18.85 37.49,18.8 36.98,18.8 DAC2.3 | 33.22,12.39 33.22,11.58 33.27,11.53 | 33.22,12.39 33.22,13.92 C7.1 | 33.27,11.53 33.43,11.38 34.24,11.38 ADC1.8 | 33.22,12.39 29.97,12.39 ADC1.1 | v32.92,11.18 33.27,11.53 | ADC2.8 41.76,11.48 40.84,11.48 40.03,12.29 40.03,15.04 37.59,17.48 37.59,18.8 37.54,18.85 | v32,19.41 31.39,18.8 30.79,18.8 DAC1.3 | v36.98,22.05 36.98,22.23
  Top 0.254: C4.1 36.98,22.23 37.78,22.23
  Bottom 0.203: 32.92,9.75 38.61,9.75 TP8.TP | 32.92,9.75 30.48,9.75 TP7.TP | 32.92,9.75 v32.92,11.18 32.92,18.49 v32,19.41 | v32,19.41 29.77,21.64 TP5.TP | 36.98,20.93 33.43,20.93 32,19.51 v32,19.41 | 36.98,20.93 38.71,20.93 TP6.TP | 36.98,20.93 v36.98,22.05
FILTERED_GND  (via drill 0.51)
  Top 0.203: DAC2.2 36.98,19.71 37.39,19.71 37.9,20.22 37.9,21.03 37.9,21.26 34.61,21.27 34.03,21.27 34,21.34 34,21.65 34.14,22.15 C4.2 | 32.36,14.78 32.41,14.83 33.93,14.83 34.75,14.02 C7.2 | 32.36,14.78 30.99,13.41 29.67,13.41 28.85,12.6 28.85,11.58 29.06,11.38 29.87,11.38 ADC1.3 | v29.36,19.71 30.68,19.71 DAC1.2 | v28.14,21.95 28.55,21.95 30.38,23.77 FB2.2 | v5.99,45.82 8.84,42.98 9.35,42.98 10.36,41.96 10.36,41.45 10.97,40.84 12.8,40.84 15.85,37.8 15.85,37.59 16.66,36.78 20.52,36.78 22.25,35.05 24.18,35.05 24.79,35.66 26.11,35.66 26.72,35.05 28.25,35.05 31.09,32.21 31.8,32.21 32,32 32,30.79 v28.14,26.92 | v31.8,15.34 32.36,14.78
  Top 0.254: ADC2.3 38.34,11.45 38.51,11.46 38.51,12.45 ADC2.1 37.37,13.96 C7.2 | 32.64,22.26 C4.2 | DAC1.6 33.02,20.95 32.66,21.31 32.64,22.26 | 32.64,22.26 32.66,23.47 32.26,23.88 30.54,23.88 FB2.2
  Bottom 0.203: v5.99,45.82 5.18,46.63 5.18,47.95 TP13.TP | v28.14,26.92 v28.14,21.95 28.14,20.93 v29.36,19.71 31.8,17.27 v31.8,15.34
GND  (via drill 0.51, 0.61)
  Top 0.203: EXT1.4 20.32,38.1 21.54,39.32 22.86,39.32 C2.2 | v9.96,32.92 9.96,26.21 8.94,25.2 8.43,25.2 7.82,24.59 7.82,22.66 CN3.4 8.94,21.64 11.38,21.64 CN3.3 | 32.82,36.27 32.82,39.32 C3.2 32.82,39.42 32.82,41.05 v33.63,41.86 | 34.14,26.11 C5.2 | R1.1 52.53,14.02 52.53,10.67 R3.1 | R6.2 47.75,10.67 R5.2 47.75,10.57 48.87,9.45 50.39,9.45 51.61,10.67 52.43,10.67 R3.1 | CN2.22 60.96,17.17 62.99,15.14 62.99,10.06 62.38,9.45 53.65,9.45 52.53,10.57 R3.1 | CN1.39 56.69,51.21 56.69,43.99 57.71,42.98 59.94,42.98 60.96,41.96 CN2.4 | HAT_EEPROM.4 44.7,37.59 45.31,37.59 HAT_EEPROM.3 45.41,37.59 45.92,37.59 HAT_EEPROM.2 46.02,37.59 46.63,37.59 HAT_EEPROM.1 | HAT_EEPROM.1 46.74,37.59 46.74,39.83 C6.2 46.84,39.83 47.45,40.44 47.55,40.44 | 47.55,40.44 49.68,40.44 52.02,38.1 EXT2.4 | 47.55,40.44 47.55,42.27 44.4,45.41 40.23,45.41 38.81,46.84 38.81,51.21 CN1.25 | C5.2 34.24,26.11 37.29,29.16 40.93,29.16 47.14,29.16 47.85,29.87 47.85,36.37 46.74,37.49 HAT_EEPROM.1 | v17.88,21.34 18.29,21.74 18.29,22.55 PWM.14 | C1.2 27.64,25.5 30.28,25.5 FB2.1 30.48,25.81 32.82,25.81 | 32.82,25.81 33.83,25.81 34.04,26.01 C5.2 | v25.7,29.67 25.7,31.29 LEVELS.11 | v30.38,14.12 30.38,15.54 R2.1 | v32.82,25.91 32.82,25.81
  Top 0.254: SJ1.1 40.95,29.17 40.93,29.16
  Bottom 0.203: v9.96,32.92 10.26,33.22 11.89,33.22 12.5,33.83 12.5,34.24 16.26,38 17.07,38 EXT1.4 | v33.63,41.86 43.69,41.86 48.26,37.29 51.21,37.29 52.02,38.1 EXT2.4 | CN1.39 56.69,51.21 56.69,50.9 63.7,43.89 63.7,21.84 60.96,19.1 CN2.22 60.96,19.2 59.84,19.2 58.93,20.12 56.49,20.12 55.98,19.61 46.33,19.61 43.38,22.55 37.49,22.55 35.97,24.08 34.95,24.08 TP14.TP 34.85,24.18 32.97,26.06 | CN3.3 11.68,21.34 v17.88,21.34 27.43,21.34 | v25.7,29.67 26.11,29.67 27.99,27.79 | 27.99,27.79 28.14,27.64 31.39,27.64 32.97,26.06 | v30.38,14.12 30.38,17.68 27.43,20.62 27.43,21.34 | 27.43,21.34 27.43,27.23 27.99,27.79 | 32.97,26.06 v32.82,25.91
  Bottom 0.254: CN1.9 17.27,50.04 EXT1.4
  pour Bottom: 0,0 0,55.88 64.77,55.88 64.77,0
  pour Top: 0,55.88 64.77,55.88 64.77,0 0,0
GPIO04
  Bottom 0.203: CN1.7 16.05,51.31 16.05,52.32 17.37,53.65 17.37,54.15 18.49,55.27 43.99,55.27 45.31,53.95 45.31,53.34 46.33,52.32 46.94,52.32 47.85,51.41 47.85,50.8 58.22,40.44 59.94,40.44 60.96,39.42 CN2.6
GPIO05  (via drill 0.61)
  Top 0.203: v54.97,40.54 57.2,38.3 58.52,38.3 59.94,36.88 60.96,36.88 CN2.8
  Bottom 0.203: v54.97,40.54 54.66,40.54 43.99,51.21 CN1.29
GPIO06
  Top 0.203: CN1.31 46.53,51.21 46.53,47.24 56.19,37.59 56.19,36.58 57.4,35.36 59.94,35.36 60.96,34.34 CN2.10
GPIO12
  Top 0.203: CN1.32 46.43,53.75 46.43,52.73 45.31,51.61 45.31,47.85 55.78,37.39 55.78,35.36 58.32,32.82 59.94,32.82 60.96,31.8 CN2.12
GPIO13
  Bottom 0.203: CN1.33 49.07,51.31 50.09,51.31 51.1,52.32 52.02,52.32 52.93,51.41 52.93,50.8 58.22,45.52 58.93,45.52 59.84,44.6 59.84,43.99 60.86,42.98 61.47,42.98 62.48,41.96 62.48,30.79 60.96,29.26 CN2.14
GPIO16
  Top 0.203: CN1.36 51.61,53.85 52.63,53.85 53.65,54.86 57.1,54.86 58.22,53.75 58.22,49.38 63.3,44.3 63.3,29.06 60.96,26.72 CN2.16
GPIO17  (via drill 0.61)
  Top 0.203: v55.88,33.53 55.88,34.04 53.34,36.58 53.34,38.61 45.72,46.23 v40.54,46.23 | v30.79,41.86 v32.51,43.59 | v28.14,46.13 v28.14,44.5 | v25.81,46.53 21.13,51.21 CN1.11
  Bottom 0.203: CN2.18 60.96,25.09 59.54,26.52 59.54,27.13 58.93,27.74 57.51,27.74 57.4,27.64 56.79,27.64 55.88,28.55 v55.88,33.53 | v40.54,46.23 35.15,46.23 v32.51,43.59 | v28.14,44.5 v30.79,41.86 | v28.14,46.13 26.21,46.13 v25.81,46.53
GPIO18
  Bottom 0.203: CN1.12 21.03,53.75 21.03,52.73 19.91,51.61 19.91,42.88 20.52,42.27 20.52,40.03 21.34,39.22 24.69,39.22 35.05,28.85 37.59,28.85 41.55,24.89 41.55,24.59 42.16,23.98 48.36,23.98 49.28,23.06 59.54,23.06 60.96,21.64 CN2.20
GPIO19
  Bottom 0.203: CN1.35 51.61,51.21 51.61,48.77 58.42,41.96 CN2.3
GPIO20
  Top 0.203: CN2.5 58.42,40.34 55.17,43.59 55.17,52.73 54.15,53.75 CN1.38
GPIO21
  Top 0.203: CN1.40 56.69,53.75 56.69,52.73 57.71,51.71 57.71,45.31 57.3,44.91 57.3,43.99 57.91,43.38 61.06,43.38 62.08,42.37 62.08,36.37 61.47,35.76 59.44,35.76 58.42,36.78 CN2.7
GPIO22
  Bottom 0.203: CN1.15 26.21,51.21 26.21,49.17 31.7,43.69 31.7,42.67 33.53,40.84 44.09,40.84 50.6,34.34 58.42,34.34 CN2.9
GPIO23  (via drill 0.61)
  Top 0.203: CN2.11 58.42,32.11 53.75,36.78 53.75,38.81 43.69,48.87 v39.62,48.87
  Bottom 0.203: v39.62,48.87 37.39,51.1 37.39,51.71 36.47,52.63 27.33,52.63 26.21,53.75 CN1.16
GPIO24  (via drill 0.51)
  Top 0.203: v45.21,55.07 30.99,55.07 29.77,53.85 28.75,53.85 CN1.18 | v47.85,48.77 v47.85,52.43
  Bottom 0.203: v45.21,55.07 46.74,55.07 47.85,53.95 v47.85,52.43 | v47.85,48.77 57.3,39.32 57.3,38.91 58.32,37.9 58.93,37.9 59.84,36.98 59.84,36.37 60.86,35.36 61.47,35.36 62.08,34.75 62.08,31.29 61.06,30.28 59.44,30.28 58.42,29.26 CN2.13
GPIO25
  Bottom 0.203: CN1.22 33.73,53.85 32.72,53.85 31.7,54.86 25.7,54.86 24.69,53.85 24.69,53.34 23.67,52.32 23.16,52.32 22.15,51.31 22.15,50.19 21.03,49.07 21.03,45.41 23.16,43.28 25.6,43.28 28.45,40.44 42.88,40.44 51.61,31.7 53.44,31.7 55.47,29.67 55.47,28.35 57.1,26.72 58.42,26.72 CN2.15
GPIO26  (via drill 0.61)
  Top 0.203: v57,36.88 57,37.39 54.15,40.23 54.15,51.21 CN1.37 | v57.1,28.45 57.1,25.5 58.42,24.18 CN2.17
  Bottom 0.203: v57,36.88 57,36.68 58.32,35.36 58.93,35.36 59.54,34.75 59.54,31.29 58.52,30.28 57.91,30.28 57.1,29.46 v57.1,28.45
GPIO27  (via drill 0.61)
  Top 0.203: v29.97,48.06 27.74,48.06 24.59,51.21 23.67,51.21 CN1.13 | v43.08,48.06 v41.45,48.06 | v42.77,49.68 42.77,51.61 43.79,52.63 44.3,52.63 45.31,53.65 45.31,54.15 46.02,54.86 v50.6,54.86 | v62.89,24.49 61.06,22.66 59.44,22.66 58.42,21.64 CN2.19
  Bottom 0.203: v41.45,48.06 v29.97,48.06 | v43.08,48.06 43.08,49.38 v42.77,49.68 | v50.6,54.86 52.02,54.86 52.93,53.95 52.93,53.34 53.95,52.32 54.56,52.32 55.47,51.41 55.47,50.8 60.76,45.52 61.47,45.52 62.89,44.09 v62.89,24.49
I2C_3V_CLOCK  (via drill 0.51)
  Top 0.203: v15.44,42.47 19.3,42.47 20.02,43.18 24.38,43.18 MF1.2 | 27.38,20.47 27.23,20.32 27.23,16.66 | 27.38,20.47 28.14,21.23 31.5,21.23 31.7,21.03 31.7,20.73 32.72,19.71 33.22,19.71 DAC1.5 | 27.23,16.66 27.23,15.95 27.03,15.75 25.81,15.75 25.5,16.05 25.5,16.76 PWM.26 | v35.66,12.39 34.34,12.39 ADC1.10 | ADC2.10 41.76,12.5 41.15,13.11 v40.74,13.11 40.74,14.94 39.62,16.05 39.62,17.07 | 39.62,17.07 38.61,17.07 38.2,17.48 38.2,18.8 39.01,19.61 39.52,19.61 DAC2.5 | 39.62,17.07 40.34,17.07 48.26,24.99 48.26,25.2 RB1.8 | 27.23,16.66 32.51,16.66 v33.63,15.54 | v10.36,20.52 8.43,20.52 7.42,21.54 7.42,39.42 8.84,40.84 8.84,41.86 CN3.20 | v26.72,20.52 27.33,20.52 27.38,20.47
  Bottom 0.203: 15.44,42.98 15.44,45.41 12.9,47.95 TP12.TP 12.9,48.06 13.41,48.56 13.41,51.21 CN1.5 | 15.44,42.98 v15.44,42.47 | 15.44,42.98 10.97,42.98 9.96,41.96 8.94,41.96 CN3.20 | v40.74,13.11 40.03,12.39 v35.66,12.39 33.63,14.43 v33.63,15.54 | v26.72,20.52 v10.36,20.52
I2C_3V_DATA  (via drill 0.51)
  Top 0.203: MF2.2 18.59,43.28 14.33,43.28 14.02,43.59 12.09,43.59 11.89,43.38 9.96,43.38 CN3.22 7.21,46.13 7.21,52.12 7.42,52.32 9.25,52.32 10.26,51.31 10.87,51.31 CN1.3 | v28.96,18.09 31.5,18.09 32.11,18.69 33.22,18.69 DAC1.4 | v26.01,18.19 26.01,16.87 PWM.27 | RB1.7 47.35,25.2 47.35,24.89 41.25,18.8 39.52,18.8 DAC2.4 39.52,18.69 38.91,18.09 v38.91,17.78 | v36.37,13.21 36.37,12.09 35.97,11.68 35.36,11.68 35.15,11.89 34.34,11.89 ADC1.9 | 42.82,12.14 42.88,12.19 42.88,13.82 v40.34,16.36 | 42.82,12.14 42.67,11.99 41.86,11.99 ADC2.9 | 42.82,12.14 v43.18,11.79 | v6.71,24.79 v6.71,42.27
  Bottom 0.203: TP11.TP 9.14,48.06 9.14,49.48 10.87,51.21 CN1.3 | v28.96,18.09 26.11,18.09 v26.01,18.19 20.73,18.19 18.8,20.12 10.97,20.12 10.36,19.51 | v36.37,13.21 36.37,15.24 v38.91,17.78 v40.34,16.36 | 10.36,19.51 10.36,18.59 21.44,7.52 40.13,7.52 43.18,10.57 v43.18,11.79 | v6.71,42.27 CN3.22 | v6.71,24.79 8.84,22.66 9.35,22.66 9.96,22.05 9.96,21.13 9.65,20.83 9.65,20.22 10.36,19.51
I2C_5V_CLOCK  (via drill 0.51)
  Top 0.203: v44.81,26.01 46.13,26.01 46.53,25.6 46.53,25.3 RB1.6 46.53,25.2 46.53,24.89 44.91,23.27 v42.27,23.27 | v49.28,25.3 49.28,24.08 v49.48,23.88 | v22.55,35.76 25.5,38.71 25.5,41.96 26.42,42.88 26.42,44.09 MF1.3
  Bottom 0.203: CN3.19 11.38,41.86 10.97,41.86 9.55,40.44 8.43,40.44 6.4,38.41 6.4,27.64 8.43,25.6 9.35,25.6 10.36,26.62 10.36,27.13 11.38,28.14 14.73,28.14 17.07,30.48 EXT1.1 17.27,30.48 v22.55,35.76 22.55,35.66 25.4,35.66 32.61,28.45 37.39,28.45 38.81,27.03 38.81,26.72 v42.27,23.27 | v44.81,26.01 46.94,26.01 48.77,24.18 49.48,24.18 | 49.48,24.18 50.6,24.18 53.75,27.33 TP10.TP | EXT2.1 51.71,30.48 49.17,27.94 49.17,25.4 v49.28,25.3 | 49.48,24.18 v49.48,23.88
I2C_5V_DATA  (via drill 0.51)
  Top 0.203: CN3.21 11.68,44.2 20.73,44.2 MF2.3 20.83,44.09 v23.57,44.09 | v44.09,25.2 45.62,25.2 RB1.5 | EXT2.2 52.02,33.02 47.75,28.75 45.82,28.75 44.5,27.43 v44.09,27.43 43.38,26.72 v38.1,26.72 | EXT1.2 17.78,33.02 19.41,31.39 v24.79,31.39 | v28.75,39.73 v28.75,41.15
  Bottom 0.203: TP9.TP 14.63,31.29 15.34,31.29 17.07,33.02 EXT1.2 | v44.09,27.43 v44.09,25.2 43.28,24.38 42.37,24.38 41.96,24.79 41.96,25.09 36.78,30.28 35.56,30.28 32.11,33.73 32.11,36.88 32.51,37.29 35.46,37.29 37.08,38.91 37.08,39.52 36.58,40.03 29.57,40.03 29.26,39.73 v28.75,39.73 | v24.79,31.39 28.45,31.39 34.34,25.5 36.47,25.5 36.68,25.3 37.29,25.3 38.1,26.11 v38.1,26.72 | v23.57,44.09 25.81,44.09 v28.75,41.15
IDSC  (via drill 0.61)
  Top 0.203: 41.15,43.08 41.25,43.18 | 41.25,43.18 v42.27,44.2 | HAT_EEPROM.6 45.41,31.7 45.41,30.99 45.62,30.79 46.94,30.79 47.14,30.99 47.14,33.83 41.96,39.01 41.96,42.37 41.25,43.08 R9.1 41.25,43.18
  Bottom 0.203: v42.27,44.2 42.27,48.36 40.23,50.39 40.23,51.61 41.35,52.73 41.35,53.75 CN1.28
IDSD  (via drill 0.51)
  Top 0.203: CN1.27 41.35,51.31 40.34,51.31 39.32,52.32 38.41,52.32 37.69,51.61 37.69,40.44 39.01,39.12 R10.1 39.12,39.01 v39.12,37.29 | v42.27,34.14 44.6,31.8 HAT_EEPROM.5
  Bottom 0.203: v39.12,37.29 v42.27,34.14
LEDOUT
  Top 0.203: LED1.C 61.47,14.02 59.94,14.02 58.83,12.9 55.58,12.9 54.46,14.02 R1.2
LEDOUT1
  Top 0.203: LED2.C 58.01,10.67 54.46,10.67 R3.2
N$2
  Top 0.203: T1.B2 54.66,17.78 53.85,17.78 T1.B1 53.75,17.78 52.93,17.78 T1.C1 52.93,17.68 51.51,16.26 51.51,13.92 49.68,12.09 49.68,10.67 R5.1
N$3
  Top 0.203: RB1.2 47.45,26.82 48.26,26.82 RB1.1 48.36,26.82 50.49,26.82 50.8,27.13 SJ3.1
N$4
  Top 0.203: RB1.4 45.72,26.82 46.53,26.82 RB1.3 46.63,26.72 46.63,26.42 47.04,26.01 49.99,26.01 50.8,25.2 SJ2.2
N$8
  Top 0.203: LEVELS.10 25.7,37.19 25.7,36.68 26.92,35.46 28.45,35.46 31.29,32.61 32.61,32.61 34.24,30.99 R7.1
OE
  Top 0.254: PWM.23 23.48,13.35 23.5,13.34 28.58,13.34 R2.2
PWM_1
  Top 0.254: PWM.6 23.48,25.07 23.5,25.08 23.5,25.4 21.27,27.62 13.34,27.62 13.34,10.16 10.16,10.16 CN4.2
PWM_2
  Top 0.254: PWM.7 22.85,24.75 22.86,24.77 22.86,25.08 20.95,26.99 13.97,26.99 13.97,9.53 11.43,9.53 11.43,5.08 CN4.1
PWM_3
  Top 0.254: PWM.8 22.19,24.41 22.23,24.45 22.23,24.77 20.64,26.35 14.61,26.35 14.61,8.89 12.7,8.89 CN4.4
PWM_4
  Top 0.254: PWM.9 21.55,24.41 21.59,24.45 20.32,25.72 15.24,25.72 15.24,8.26 13.97,8.26 13.97,5.08 CN4.3
PWM_5
  Top 0.254: PWM.10 20.89,24.19 20,25.08 15.88,25.08 15.88,7.62 15.24,7.62 CN4.6
PWM_6
  Top 0.254: PWM.11 20.23,23.9 19.68,24.45 16.51,24.45 16.51,5.08 CN4.5
PWM_7
  Top 0.254: PWM.12 19.6,23.58 19.37,23.81 17.14,23.81 17.14,7.62 CN4.8
PWM_8
  Top 0.254: CN4.7 19.05,5.08 19.05,7.62 17.78,7.62 17.78,19.37 19.26,20.21 19.37,21.27 18.94,21.7 PWM.13
PWM_9
  Top 0.254: PWM.15 18.3,8.37 18.41,8.26 20.32,8.26 CN4.10
PWM_10
  Top 0.254: PWM.16 18.94,9 19.05,8.89 21.59,8.89 21.59,5.08 CN4.9
PWM_11
  Top 0.254: PWM.17 19.6,9.61 19.68,9.53 22.86,9.53 CN4.12
PWM_12
  Top 0.254: PWM.18 20.23,10.25 20.32,10.16 24.13,10.16 24.13,5.08 CN4.11
PWM_13
  Top 0.254: PWM.19 20.89,10.86 20.95,10.79 25.4,10.79 CN4.14
PWM_14
  Top 0.254: PWM.20 21.55,11.46 21.59,11.43 26.67,11.43 26.67,5.08 CN4.13
PWM_15
  Top 0.254: PWM.21 22.19,12.1 22.23,12.06 27.3,12.06 27.3,7.62 27.94,7.62 CN4.16
PWM_16
  Top 0.254: PWM.22 22.85,12.71 22.86,12.7 27.94,12.7 27.94,8.26 29.21,8.26 29.21,5.08 CN4.15
SERIAL_3V_RX
  Top 0.203: LEVELS.9 26.31,37.29 26.31,42.16 27.33,43.18 27.33,46.63 23.88,50.09 23.16,50.09 22.15,51.1 22.15,51.71 21.23,52.63 19.71,52.63 18.59,53.75 CN1.10
  Bottom 0.254: CN1.10 17.27,52.58 17.27,50.8 16.26,49.53 16.26,40.64 13.72,38.1 6.86,38.1 6.86,28.7 CN3.8
SERIAL_3V_TX  (via drill 0.61)
  Top 0.203: v28.14,43.38 27.03,42.27 27.03,37.29 LEVELS.8 | v21.84,48.77 19.61,51 19.61,51.71 18.69,52.63 17.17,52.63 16.05,53.75 CN1.8
  Bottom 0.203: v28.14,43.38 27.23,43.38 v21.84,48.77 | CN3.6 8.84,24.18 8.84,24.59 5.99,27.43 5.99,43.08 9.55,46.63 10.26,46.63 11.48,47.85 11.48,50.29 12.29,51.1 12.29,51.61 13.31,52.63 14.83,52.63 15.95,53.75 CN1.8
SERIAL_5V_RX  (via drill 0.61)
  Top 0.203: v20.62,32.21 25.91,32.21 26.21,31.9 26.21,31.39 LEVELS.12
  Bottom 0.203: v20.62,32.21 15.14,26.72 11.48,26.72 CN3.7
SERIAL_5V_TX  (via drill 0.61)
  Top 0.203: v26.72,30.18 26.92,30.38 26.92,31.29 LEVELS.13 | v12.5,25.7 12.5,25.2 CN3.5
  Bottom 0.203: v26.72,30.18 26.21,30.18 25.7,30.68 19.71,30.68 14.73,25.7 v12.5,25.7
SPI_1  (via drill 0.51)
  Top 0.203: v34.14,33.33 34.14,33.73 31.6,36.27 31.6,37.19 LEVELS.1 | v36.37,35.15 36.37,38.2 37.08,38.91 37.08,42.88 v36.98,42.98 | v10.67,30.48 10.67,29.97 10.36,29.67 10.36,23.67 11.38,22.66 11.89,22.66 12.6,21.95 v12.6,18.19 | v41.45,21.84 41.45,23.88 v42.67,25.09
  Bottom 0.203: v34.14,33.33 34.54,33.33 34.59,33.38 | v36.37,35.15 34.59,33.38 | v36.98,42.98 42.16,42.98 43.89,44.7 43.89,49.68 42.47,51.1 42.47,54.25 41.86,54.86 37.39,54.86 36.37,53.85 CN1.24 | v10.67,30.48 9.45,29.26 8.94,29.26 CN3.10 | v12.6,18.19 17.78,18.19 28.04,7.92 39.93,7.92 41.45,9.45 v41.45,21.84 | v42.67,25.09 42.67,25.3 34.59,33.38
SPI_2  (via drill 0.51)
  Top 0.203: v32.82,34.04 32.36,34.49 | 32.36,34.49 30.28,36.58 30.28,37.19 LEVELS.3 | v35.36,35.15 35.36,38.71 35.46,38.81 35.46,50.49 35.15,50.8 35.15,51.61 36.17,52.63 37.69,52.63 38.81,53.75 CN1.26 | v12.8,39.83 12.19,40.44 10.97,40.44 10.36,39.83 10.36,39.32 9.35,38.3 8.84,38.3 7.82,37.29 7.82,33.83 8.84,32.82 8.84,31.8 CN3.12 | v19.81,40.23 v14.73,40.23 | v35.36,29.57 v33.33,29.57 | 32.36,34.49 v31.39,33.53
  Bottom 0.203: v32.82,34.04 34.24,34.04 v35.36,35.15 | v12.8,39.83 14.33,39.83 v14.73,40.23 | v19.81,40.23 20.12,39.93 20.12,39.83 21.13,38.81 24.08,38.81 v33.33,29.57 | v31.39,33.53 v35.36,29.57
SPI_5V_1
  Top 0.203: CN3.9 12.39,28.25 21.34,28.25 21.64,27.94 28.55,27.94 31.5,30.89 31.5,31.29 LEVELS.20
SPI_5V_2
  Top 0.203: CN3.11 14.53,28.65 21.54,28.65 21.84,28.35 27.64,28.35 30.18,30.89 30.18,31.29 LEVELS.18
SPI_5V_CLOCK  (via drill 0.61)
  Top 0.203: v18.8,33.12 27.03,33.12 28.25,31.9 28.25,31.39 LEVELS.15 | v15.54,35.05 15.54,35.26 CN3.17
  Bottom 0.203: v18.8,33.12 17.58,34.34 16.26,34.34 v15.54,35.05
SPI_5V_MISO
  Top 0.203: CN3.15 10.36,35.76 10.36,33.83 10.97,33.22 11.48,33.22 15.65,29.06 21.74,29.06 22.05,28.75 26.72,28.75 28.85,30.89 28.85,31.29 LEVELS.16
SPI_5V_MOSI
  Top 0.203: LEVELS.17 29.46,31.39 29.46,31.9 27.13,34.24 11.48,34.24 CN3.13
SPI_CLOCK  (via drill 0.61)
  Top 0.203: v29.57,46.94 29.57,43.69 28.45,42.57 28.14,42.57 27.43,41.86 27.43,39.12 28.25,38.3 28.25,37.29 LEVELS.6 | v13.41,41.35 19.41,41.35 19.71,41.05 v23.88,41.05 | v36.27,39.22 36.27,51.21 CN1.23
  Bottom 0.203: v29.57,46.94 29.57,47.35 29.16,47.75 29.16,48.36 29.87,49.07 34.14,49.07 36.27,51.21 CN1.23 | v13.41,41.35 12.9,40.84 11.38,40.84 9.96,39.42 8.94,39.42 CN3.18 | v23.88,41.05 25.5,41.05 28.14,38.41 35.46,38.41 v36.27,39.22
SPI_MISO  (via drill 0.51)
  Top 0.203: v30.79,49.78 30.79,44.3 28.04,41.55 28.04,39.42 28.85,38.61 28.85,37.29 LEVELS.5 28.85,37.19 v28.85,36.07 | v19.81,41.96 22.05,41.96 v22.25,41.76
  Bottom 0.203: v30.79,49.78 32.31,49.78 33.73,51.21 CN1.21 | v19.81,41.96 19.1,41.25 19.1,38.3 17.68,36.88 16.26,36.88 12.19,32.82 10.97,32.82 10.36,32.21 10.36,31.7 9.35,30.68 8.43,30.68 7.82,31.29 7.82,34.75 8.84,35.76 8.84,36.78 CN3.16 | v22.25,41.76 22.25,41.55 24.18,39.62 25.3,39.62 v28.85,36.07
SPI_MOSI  (via drill 0.51)
  Top 0.203: 29.57,39.12 29.57,37.29 LEVELS.4 | 29.57,39.12 29.57,41.76 32.41,44.6 32.41,49.17 31.29,50.29 31.29,51.21 CN1.19 | v16.36,39.52 20.42,39.52 v21.23,40.34 | 29.57,39.12 v29.67,39.12
  Bottom 0.203: v16.36,39.52 12.6,35.76 11.38,35.76 9.96,34.34 8.94,34.34 CN3.14 | v21.23,40.34 21.23,41.76 21.95,42.47 24.99,42.47 28.45,39.01 29.57,39.01 v29.67,39.12
WP
  Top 0.203: HAT_EEPROM.7 45.92,31.8 45.92,32.41 43.38,34.95 40.95,34.95 R8.1
  Top 0.254: SJ1.2 40.92,33.29 R8.1